# Altium schematic sheet fpga-bank3.SchDoc: Copper Suicide - FPGA - Bank 3
size Letter; CheckedBy: J. Brinton; CompanyName: Signal Laboratories, Inc.; DrawnBy: J. Brinton; Engineer: J. Brinton; Address1: 3479 Edison Way; Address2: Menlo Park CA 94025; Address3: +1 (877) 778-8435; Address4: siglabs.com; Revision: 3; SheetNumber: 8; SheetTotal: 47
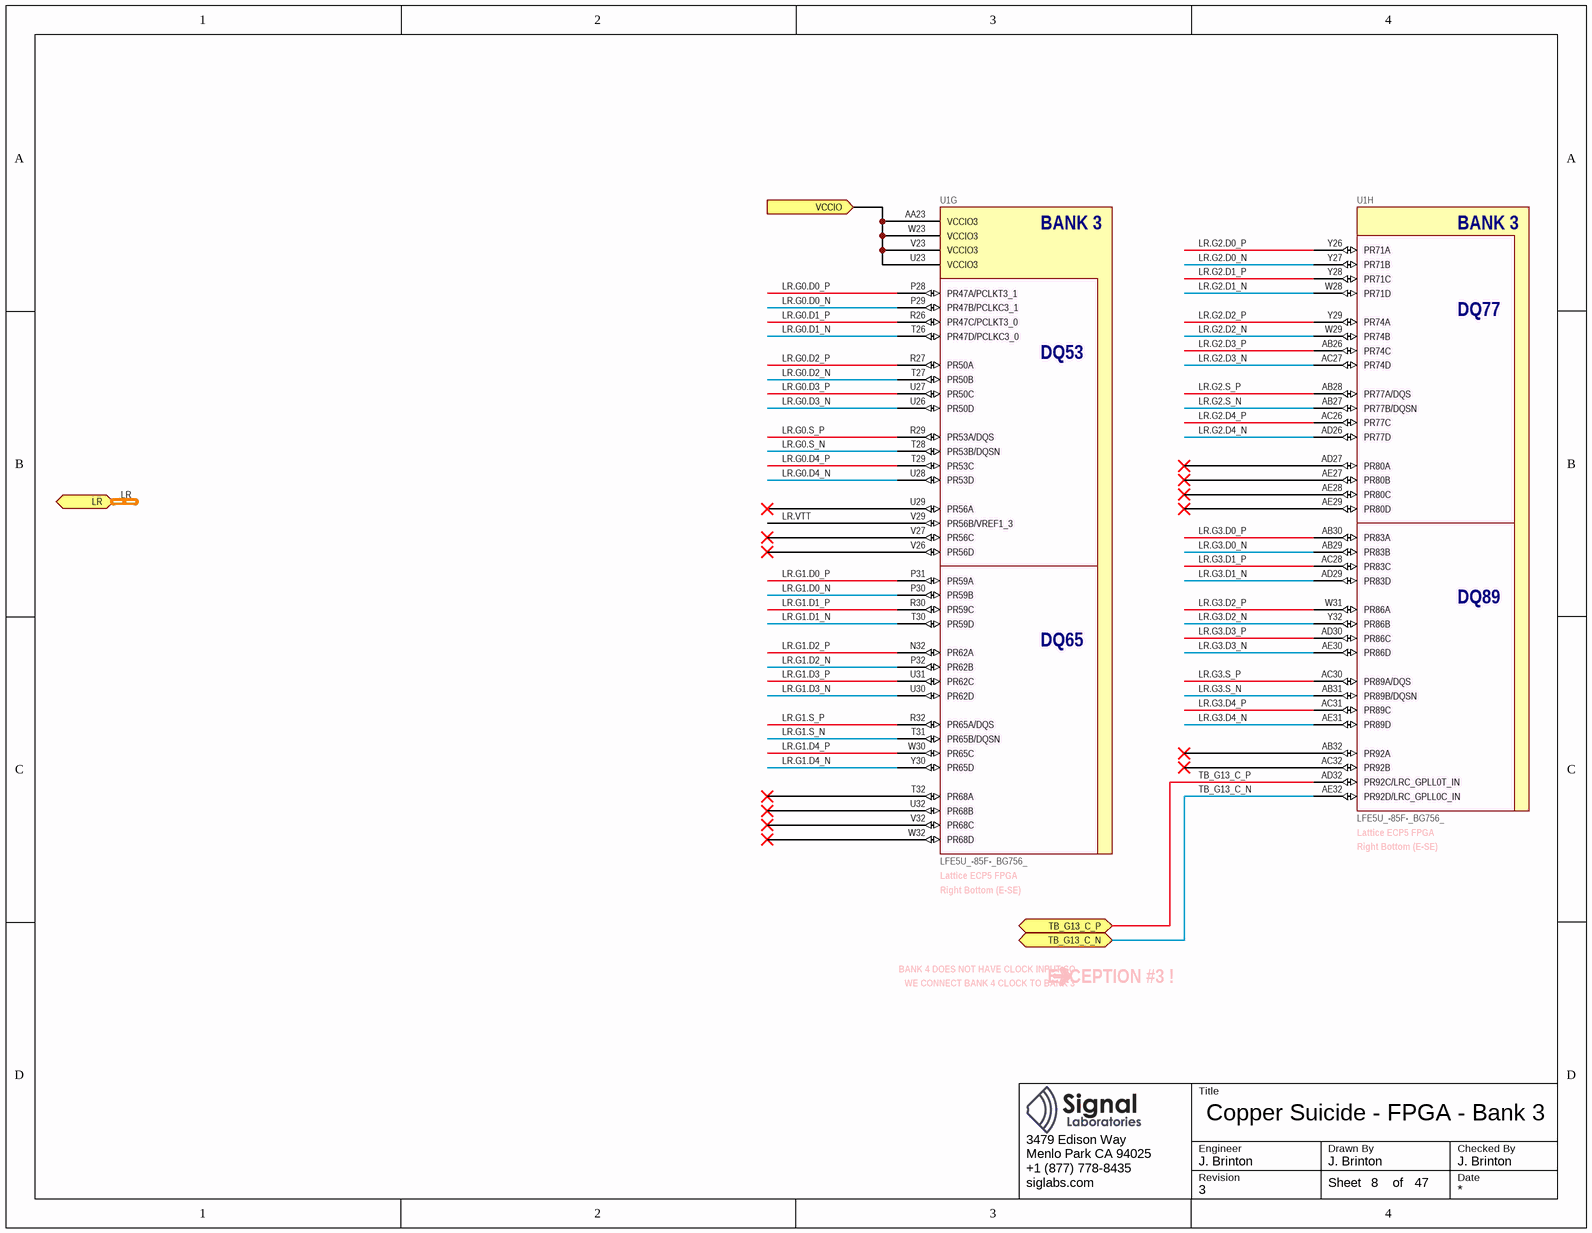
[diagram p0: fpga-bank3.SchDoc]

## Parts
U1  LFE5U_-85F-_BG756_  [caBGA756]  (parts G,H of 19)

## Ports
LR (harness DDR), TB_G13_C_N, TB_G13_C_P, VCCIO (in)

## Nets
LR.G0.D0_N: U1.P29(PR47B/PCLKC3_1)
LR.G0.D0_P: U1.P28(PR47A/PCLKT3_1)
LR.G0.D1_N: U1.T26(PR47D/PCLKC3_0)
LR.G0.D1_P: U1.R26(PR47C/PCLKT3_0)
LR.G0.D2_N: U1.T27(PR50B)
LR.G0.D2_P: U1.R27(PR50A)
LR.G0.D3_N: U1.U26(PR50D)
LR.G0.D3_P: U1.U27(PR50C)
LR.G0.D4_N: U1.U28(PR53D)
LR.G0.D4_P: U1.T29(PR53C)
LR.G0.S_N: U1.T28(PR53B/DQSN)
LR.G0.S_P: U1.R29(PR53A/DQS)
LR.G1.D0_N: U1.P30(PR59B)
LR.G1.D0_P: U1.P31(PR59A)
LR.G1.D1_N: U1.T30(PR59D)
LR.G1.D1_P: U1.R30(PR59C)
LR.G1.D2_N: U1.P32(PR62B)
LR.G1.D2_P: U1.N32(PR62A)
LR.G1.D3_N: U1.U30(PR62D)
LR.G1.D3_P: U1.U31(PR62C)
LR.G1.D4_N: U1.Y30(PR65D)
LR.G1.D4_P: U1.W30(PR65C)
LR.G1.S_N: U1.T31(PR65B/DQSN)
LR.G1.S_P: U1.R32(PR65A/DQS)
LR.G2.D0_N: U1.Y27(PR71B)
LR.G2.D0_P: U1.Y26(PR71A)
LR.G2.D1_N: U1.W28(PR71D)
LR.G2.D1_P: U1.Y28(PR71C)
LR.G2.D2_N: U1.W29(PR74B)
LR.G2.D2_P: U1.Y29(PR74A)
LR.G2.D3_N: U1.AC27(PR74D)
LR.G2.D3_P: U1.AB26(PR74C)
LR.G2.D4_N: U1.AD26(PR77D)
LR.G2.D4_P: U1.AC26(PR77C)
LR.G2.S_N: U1.AB27(PR77B/DQSN)
LR.G2.S_P: U1.AB28(PR77A/DQS)
LR.G3.D0_N: U1.AB29(PR83B)
LR.G3.D0_P: U1.AB30(PR83A)
LR.G3.D1_N: U1.AD29(PR83D)
LR.G3.D1_P: U1.AC28(PR83C)
LR.G3.D2_N: U1.Y32(PR86B)
LR.G3.D2_P: U1.W31(PR86A)
LR.G3.D3_N: U1.AE30(PR86D)
LR.G3.D3_P: U1.AD30(PR86C)
LR.G3.D4_N: U1.AE31(PR89D)
LR.G3.D4_P: U1.AC31(PR89C)
LR.G3.S_N: U1.AB31(PR89B/DQSN)
LR.G3.S_P: U1.AC30(PR89A/DQS)
LR.VTT: U1.V29(PR56B/VREF1_3)
TB_G13_C_N: U1.AE32(PR92D/LRC_GPLL0C_IN) ; port TB_G13_C_N
TB_G13_C_P: U1.AD32(PR92C/LRC_GPLL0T_IN) ; port TB_G13_C_P
VCCIO: U1.AA23(VCCIO3) U1.U23(VCCIO3) U1.V23(VCCIO3) U1.W23(VCCIO3) ; port VCCIO

Not connected (* = marked no-connect by the designer): U1 AB32(PR92A)* AC32(PR92B)* AD27(PR80A)* AE27(PR80B)* AE28(PR80C)* AE29(PR80D)* T32(PR68A)* U29(PR56A)* U32(PR68B)* V26(PR56D)* V27(PR56C)* V32(PR68C)* W32(PR68D)*

## Buses and harness runs
harness LR = port LR

## Notes on the sheet
- (near U1) Right Bottom (E-SE)
- (near U1) Lattice ECP5 FPGA
- EXCEPTION #3 !
- BANK 4 DOES NOT HAVE CLOCK INPUT SO
- WE CONNECT BANK 4 CLOCK TO BANK 3
- Title
- Engineer
- Revision
- Drawn By
- Checked By
- Date
- Sheet
- of
- (in symbol LFE5U_-85F-_BG756_, part G) BANK 3; DQ53; DQ65
- (in symbol LFE5U_-85F-_BG756_, part H) BANK 3; DQ77; DQ89

## Library data of the parts
U1 = LFE5U_-85F-_BG756_: ECP5 FPGA, 85k LUT, 756-caBGA; Manufacturer: Lattice Semiconductor; Manufacturer P/N: LFE5U_-85F-_BG756_